# EAGLE board MotorControl_M (EAGLE 9.6.2), part 1 of 2
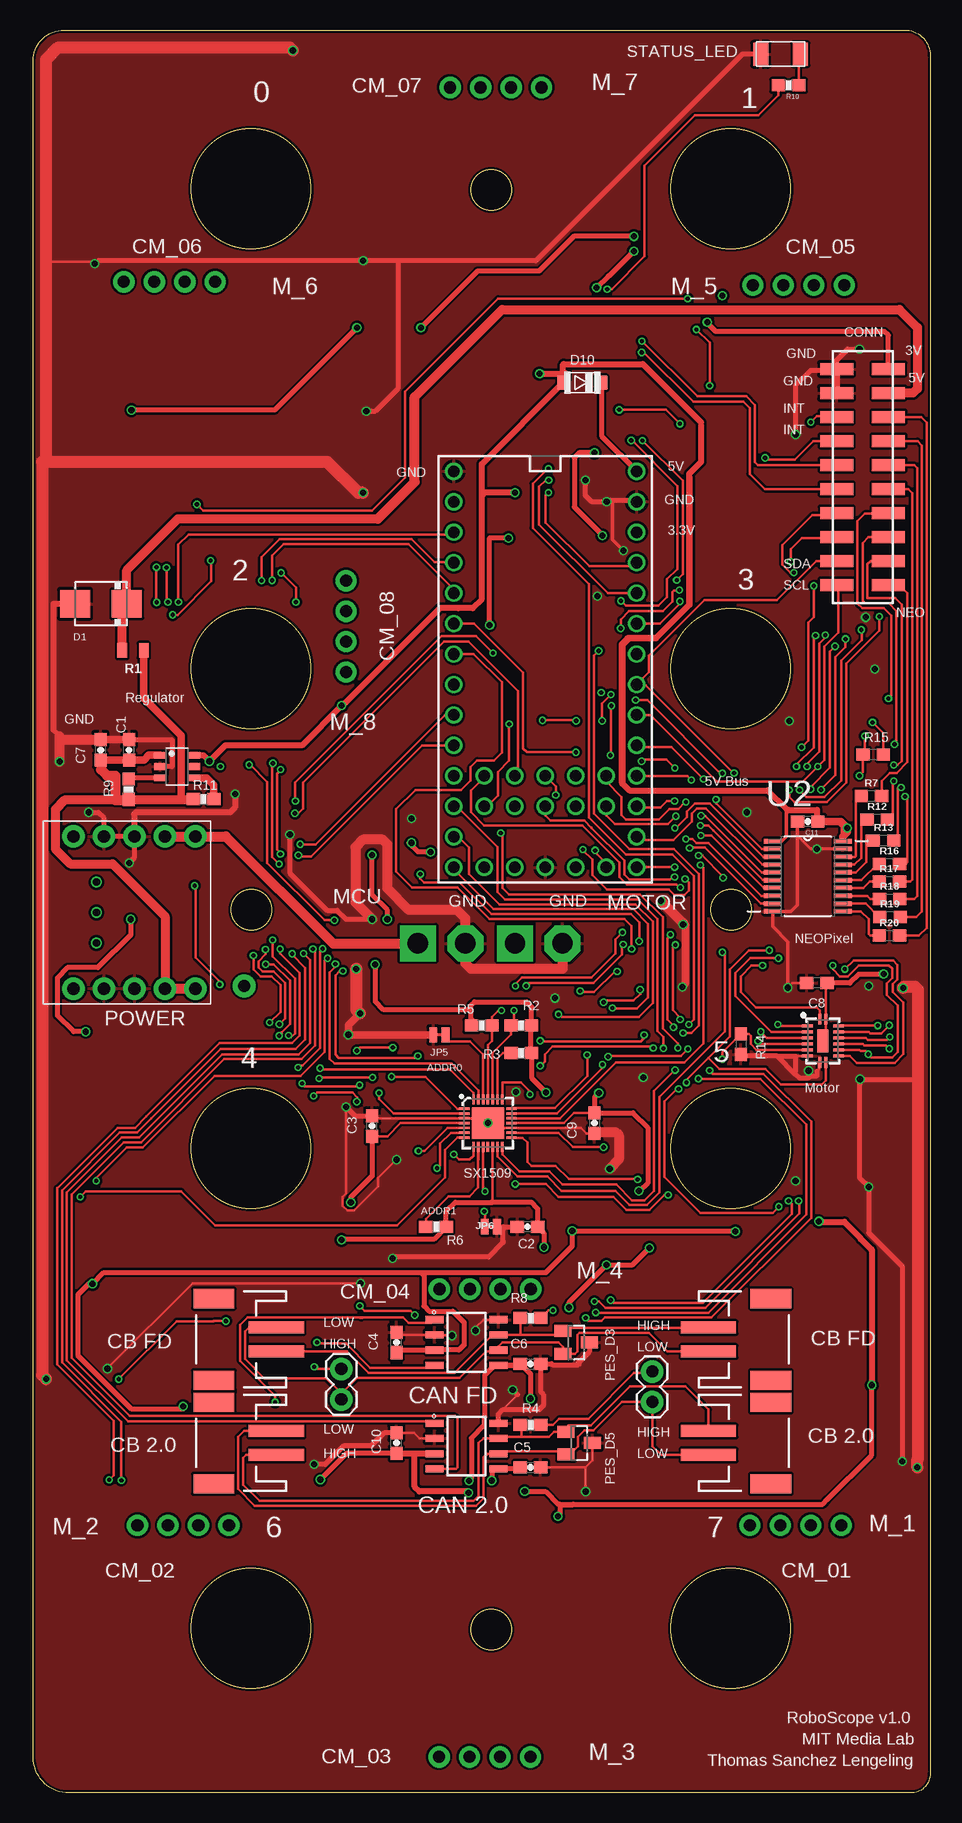
[diagram p3: board, top side]
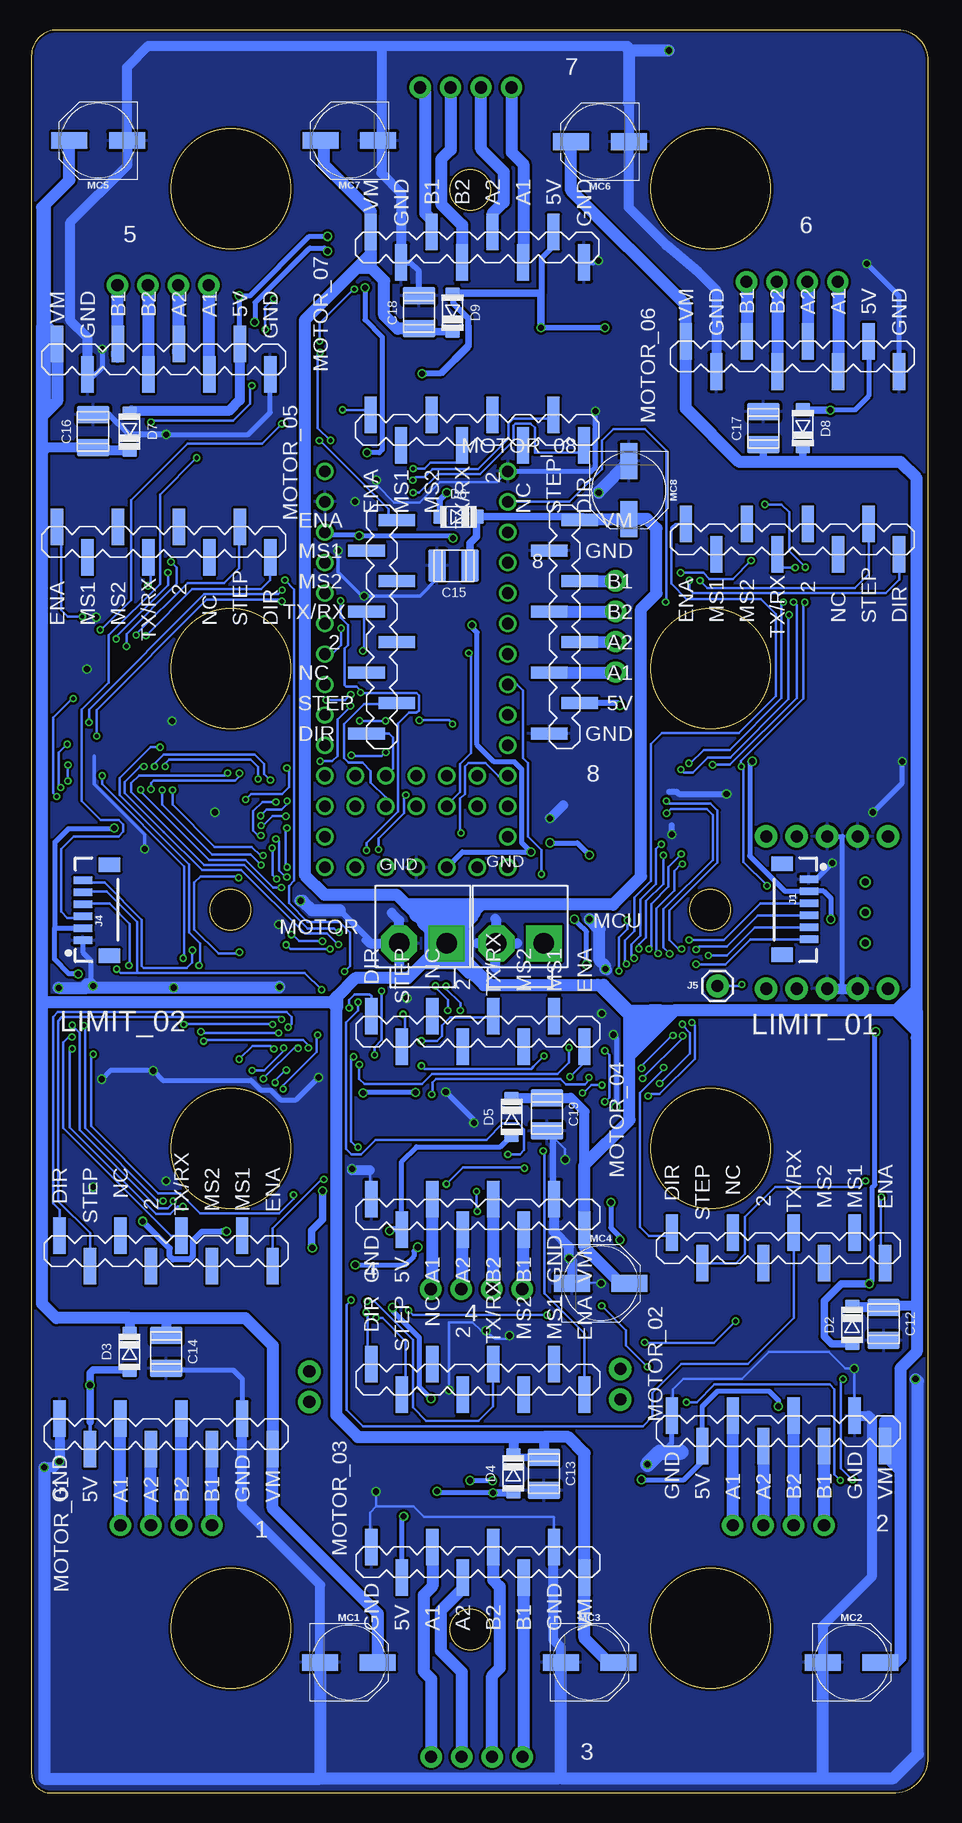
[diagram p4: board, bottom side, seen from below]

Size 74.79 x 146.95 mm. Coordinates in mm from the lower left corner, seen from the top.
Outline: 0,2.98 0,144.39 arc-90 2.56,146.95 72.66,146.95 arc-90 74.79,144.82 74.79,1.6 arc-90 73.19,0 2.98,0 arc-90 0,2.98
Outline: circle at 18.2,73.62 radius 1.7
Outline: circle at 38.2,133.62 radius 1.7
Outline: circle at 38.2,13.62 radius 1.7
Outline: circle at 58.2,73.62 radius 1.7
Outline: circle at 58.16,133.71 radius 5
Outline: circle at 58.16,93.71 radius 5
Outline: circle at 58.16,53.71 radius 5
Outline: circle at 58.16,13.71 radius 5
Outline: circle at 18.16,13.71 radius 5
Outline: circle at 18.16,53.71 radius 5
Outline: circle at 18.16,93.71 radius 5
Outline: circle at 18.16,133.71 radius 5
Copper layers (1*16): Top 0.035mm / dielectric 1.5mm / Bottom 0.035mm
Design rules "SparkFun-2-Layer-Minimum-JLCPCB": minimum track width 5mil, minimum drill 0.3mm, track to track 5mil, track to pad 5mil, pad to pad 5mil, via to via 5mil, smd to smd 5mil, copper to edge 7mil, drill to drill 7mil, minimum pad ring 5mil, minimum via ring 5mil, stop-mask expansion 2.5mil, vias tented up to drill 25mil, thermal gap 10mil
Net classes: 0 default: drill 0.35 mm, clearance 0.2 mm; 1 gnd: width 0.2 mm, drill 0.508 mm, clearance 0.2 mm; 3 vcc: width 0.2 mm, drill 0.508 mm, clearance 0.2 mm; 4 vcc5: width 0.55 mm, drill 0.508 mm, clearance 0.2 mm

## Footprints (pad centres in the part's own frame; a part is rotated, then mirrored left to right if it is on the bottom)
0603-CAP = smd 1.1 x 1: 1 -0.85,0; 2 0.85,0
0603 = smd 1.1 x 1: 1 -0.85,0; 2 0.85,0
C1210 = smd 2.7 x 1.45: 1 0,1.4; 2 0,-1.35
JST-2-SMD = smd 1 x 4.6: 1 -1,-3.7; 2 1,-3.7 | smd 1.6 x 3.4: NC1 -3.4,1.5; NC2 3.4,1.5
1X04-CLEANBIG = drill 1.016 pad 1.778: 1 -3.81,0; 2 -1.27,0; 3 1.27,0; 4 3.81,0
DO214AA = smd 2.5 x 2.3: A 2.15,0; C -2.15,0
SOD123 = smd 1.2 x 1: A 0,-1.6; C 0,1.6
1X06-1MM = smd 0.6 x 1.55: 1 -2.54,1.27; 2 -1.54,1.27; 3 -0.54,1.27; 4 0.46,1.27; 5 1.46,1.27; 6 2.46,1.27 | smd 1.2 x 1.8: P$1 -3.84,-0.955; P$2 3.76,-0.955
1X02 = drill 1.016 pad 1.88: 1 0,0; 2 2.54,0
1X01 = drill 1.016 pad 1.88: 1 0,0
SMT-JUMPER_2_NC_TRACE_NO-SILK = smd 0.635 x 1.27: 1 -0.508,0; 2 0.508,0
PANASONIC_D = smd 3 x 1.4: + 2.4,0; - -2.4,0
SOIC127P600X175-8N = smd 1.5 x 0.6: 1 -2.65,1.905; 2 -2.65,0.635; 3 -2.65,-0.635; 4 -2.65,-1.905; 5 2.65,-1.905; 6 2.65,-0.635; 7 2.65,0.635; 8 2.65,1.905
TMC2209_SMD = smd 3.048 x 1.016: 5V 8.89,-6.35; 9 -6.35,-1.27; A1 6.35,-3.81; A2 8.89,-1.27; B1 8.89,3.81; B2 6.35,1.27; DIR -8.89,-8.89; ENA -6.35,8.89; GND_0 6.35,-8.89; GND_1 6.35,6.35; MS1 -8.89,6.35; MS2 -6.35,3.81; STBY -8.89,-3.81; STEP -6.35,-6.35; TX/RX -8.89,1.27; VM 8.89,8.89
87759-20 = smd 1 x 2.75: 1 -9,-2.15; 2 -9,2.15; 3 -7,-2.15; 4 -7,2.15; 5 -5,-2.15; 6 -5,2.15; 7 -3,-2.15; 8 -3,2.15; 9 -1,-2.15; 10 -1,2.15; 11 1,-2.15; 12 1,2.15; 13 3,-2.15; 14 3,2.15; 15 5,-2.15; 16 5,2.15; 17 7,-2.15; 18 7,2.15; 19 9,-2.15; 20 9,2.15
SOT23 = smd 1 x 1.4: 1 -0.95,-1.1; 2 0.95,-1.1; 3 0,1.1
B2P-VH = drill 1.7 pad 3 square: 1 -1.98,0 | drill 1.7 pad 3 octagon: 2 1.98,0
0805 = smd 0.8 x 1.2: 1 -0.9,0; 2 0.9,0
0603-RES = smd 1.1 x 1: 1 -0.85,0; 2 0.85,0
LED1206FAB = smd 1.27 x 1.905: 1 -1.651,0; 2 1.651,0
QFN-28 = smd 0.85 x 0.2: 1 -1.975,1.2; 2 -1.975,0.8; 3 -1.975,0.4; 4 -1.975,0; 5 -1.975,-0.4; 6 -1.975,-0.8; 7 -1.975,-1.2; 15 1.975,-1.2; 16 1.975,-0.8; 17 1.975,-0.4; 18 1.975,0; 19 1.975,0.4; 20 1.975,0.8; 21 1.975,1.2 | smd 0.2 x 0.85: 8 -1.2,-1.975; 9 -0.8,-1.975; 10 -0.4,-1.975; 11 0,-1.975; 12 0.4,-1.975; 13 0.8,-1.975; 14 1.2,-1.975; 22 1.2,1.975; 23 0.8,1.975; 24 0.4,1.975; 25 0,1.975; 26 -0.4,1.975; 27 -0.8,1.975; 28 -1.2,1.975 | smd 2.65 x 2.65: 29 0,0
SOT23-6 = smd 1 x 0.55: 1 -1.4,0.95; 2 -1.4,0; 3 -1.4,-0.95; 4 1.4,-0.95; 5 1.4,0; 6 1.4,0.95
20-TSSOP = smd 1.473 x 0.356: 1 -2.921,2.921; 2 -2.921,2.286; 3 -2.921,1.626; 4 -2.921,0.965; 5 -2.921,0.33; 6 -2.921,-0.33; 7 -2.921,-0.965; 8 -2.921,-1.626; 9 -2.921,-2.286; 10 -2.921,-2.921; 11 2.921,-2.921; 12 2.921,-2.286; 13 2.921,-1.626; 14 2.921,-0.965; 15 2.921,-0.33; 16 2.921,0.33; 17 2.921,0.965; 18 2.921,1.626; 19 2.921,2.286; 20 2.921,2.921
DHVQFN-16-2.5X3.5MM = smd 0.9 x 0.24: 1 -1.8,-0.25; 8 1.8,-0.25; 9 1.8,0.25; 16 -1.8,0.25 | smd 0.24 x 0.9: 2 -1.25,-1.3; 3 -0.75,-1.3; 4 -0.25,-1.3; 5 0.25,-1.3; 6 0.75,-1.3; 7 1.25,-1.3; 10 1.25,1.3; 11 0.75,1.3; 12 0.25,1.3; 13 -0.25,1.3; 14 -0.75,1.3; 15 -1.25,1.3 | smd 1.9 x 0.9: EP 0,0
MOSFET_SLIDER = drill 1.016 pad 1.88: GND_1 1.27,8.89; GND_2 1.27,6.35; GND_3 13.97,8.89; GND_4 13.97,6.35; GND_5 13.97,3.81; ON 1.27,3.81; VIN_1 1.27,13.97; VIN_2 1.27,11.43; VOUT_1 13.97,13.97; VOUT_2 13.97,11.43 | drill 0.6: P$13 5.08,5.715; P$14 7.62,5.715; P$15 10.16,5.715
TEENSY_4.0_WITH_SMD_HEADER_PINS = drill 0.965: 0 -7.62,13.97; 1 -7.62,11.43; 2 -7.62,8.89; 3 -7.62,6.35; 3.3V 7.62,11.43; 3.3V1 -2.54,-16.51; 4 -7.62,3.81; 5 -7.62,1.27; 6 -7.62,-1.27; 7 -7.62,-3.81; 8 -7.62,-6.35; 9 -7.62,-8.89; 10 -7.62,-11.43; 11 -7.62,-13.97; 12 -7.62,-16.51; 13 7.62,-16.51; 14/A0 7.62,-13.97; 15/A1 7.62,-11.43; 16/A2 7.62,-8.89; 17/A3 7.62,-6.35; 18/A4 7.62,-3.81; 19/A5 7.62,-1.27; 20/A6 7.62,1.27; 21/A7 7.62,3.81; 22/A8 7.62,6.35; 23/A9 7.62,8.89; 24 5.08,-11.43; 25 5.08,-8.89; 26 2.54,-11.43; 27 2.54,-8.89; 28 0,-11.43; 29 0,-8.89; 30 -2.54,-11.43; 31 -2.54,-8.89; 32 -5.08,-11.43; 33 -5.08,-8.89; GND -7.62,16.51; GND1 0,-16.51; GND2 7.62,13.97; PGM 2.54,-16.51; RESET 5.08,-16.51; VBAT -5.08,-16.51; VIN 7.62,16.51

## Placement (x,y rotation side)
C1  47uf/10V  [0603-CAP]  7.99,86.95 90 top
C2  0.1uF  [0603-CAP]  41.21,47.2 180 top
C3  0.1uF  [0603-CAP]  28.26,55.58 90 top
C4  0.1uf  [0603-CAP]  30.29,37.55 90 top
C5  0.1uf  [0603-CAP]  41.47,27.13 0 top
C6  0.1uf  [0603-CAP]  41.47,35.77 0 top
C7  0.1uf  [0603-CAP]  5.63,86.95 90 top
C8  0.1uF  [0603]  65.34,67.52 180 top
C9  0.1uF  [0603-CAP]  46.8,55.83 270 top
C10  0.1uf  [0603-CAP]  30.29,29.16 90 top
C11  1uf  [0603-CAP]  64.58,80.98 180 top
C12  10uf  [C1210]  3.75,39.12 180 bottom
C13  [C1210]  32.07,26.62 180 bottom
C14  [C1210]  63.57,36.78 180 bottom
C15  [C1210]  39.56,102.29 90 bottom
C16  [C1210]  69.66,113.49 0 bottom
C17  [C1210]  13.78,113.75 0 bottom
C18  [C1210]  42.48,123.4 0 bottom
C19  [C1210]  31.82,56.6 180 bottom
CAN_INPUT  [JST-2-SMD]  16.58,37.8 90 top
CAN_INPUT1  [JST-2-SMD]  60.01,37.8 270 top
CAN_INPUT4  [JST-2-SMD]  60.01,29.16 270 top
CAN_INPUT5  [JST-2-SMD]  16.58,29.16 90 top
CM_01  1X04_STRAIGHT  [1X04-CLEANBIG]  63.57,22.31 180 top
CM_02  1X04_STRAIGHT  [1X04-CLEANBIG]  12.51,22.31 180 top
CM_03  1X04_STRAIGHT  [1X04-CLEANBIG]  37.66,3 180 top
CM_04  1X04_STRAIGHT  [1X04-CLEANBIG]  37.68,41.99 180 top
CM_05  1X04_STRAIGHT  [1X04-CLEANBIG]  63.82,125.68 0 top
CM_06  1X04_STRAIGHT  [1X04-CLEANBIG]  11.37,125.96 0 top
CM_07  1X04_STRAIGHT  [1X04-CLEANBIG]  38.58,142.17 0 top
CM_08  1X04_STRAIGHT  [1X04-CLEANBIG]  26.09,97.24 90 top
D1  S2A  [DO214AA]  5.65,99.12 180 top
D2  [SOD123]  6.37,39.02 0 bottom
D3  [SOD123]  66.61,36.78 0 bottom
D4  [SOD123]  34.61,26.62 0 bottom
D5  [SOD123]  34.76,56.34 0 bottom
D6  [SOD123]  39.18,106.38 270 bottom
D7  [SOD123]  66.61,113.49 180 bottom
D8  [SOD123]  10.48,113.75 180 bottom
D9  [SOD123]  39.69,123.4 180 bottom
D10  SOD123L  [SOD123]  45.79,117.56 270 top
DRILEGEND  [DRILEGEND]  -89,95.04 0 top  (outside the outline)
J1  [1X06-1MM]  11.24,73.61 270 bottom
J2  [1X02]  25.69,35.34 270 top
J3  [1X02]  51.63,35.13 270 top
J4  [1X06-1MM]  69.23,73.61 90 bottom
J5  [1X01]  17.59,67.26 0 bottom
JP5  JUMPER-SMT_2_NC_TRACE_NO-SILK  [SMT-JUMPER_2_NC_TRACE_NO-SILK]  33.87,63.17 180 top
JP6  JUMPER-SMT_2_NC_TRACE_NO-SILK  [SMT-JUMPER_2_NC_TRACE_NO-SILK]  38.17,47.2 180 top
MC1  100uF  [PANASONIC_D]  48.33,10.88 0 bottom
MC2  100uF  [PANASONIC_D]  6.42,10.88 0 bottom
MC3  100uF  [PANASONIC_D]  28.26,10.88 0 bottom
MC4  100uF  [PANASONIC_D]  27.32,42.48 0 bottom
MC5  100uF  [PANASONIC_D]  69.23,137.74 180 bottom
MC6  100uF  [PANASONIC_D]  27.4,137.65 180 bottom
MC7  100uF  [PANASONIC_D]  48.28,137.74 180 bottom
MC8  100uF  [PANASONIC_D]  24.99,108.6 270 bottom
MCP2562_2.0  MCP2562-E/SN  [SOIC127P600X175-8N]  36.13,28.91 0 top
MCP2562FD  MCP2562-E/SN  [SOIC127P600X175-8N]  36.13,37.55 0 top
MOTOR_01  DRV8880TMC2209  [TMC2209_SMD]  63.57,37.55 270 bottom
MOTOR_02  DRV8880TMC2209  [TMC2209_SMD]  12.51,37.8 270 bottom
MOTOR_03  DRV8880TMC2209  [TMC2209_SMD]  37.57,26.85 270 bottom
MOTOR_04  DRV8880TMC2209  [TMC2209_SMD]  37.57,55.84 270 bottom
MOTOR_05  DRV8880TMC2209  [TMC2209_SMD]  63.77,111.89 90 bottom
MOTOR_06  DRV8880TMC2209  [TMC2209_SMD]  11.34,112.12 90 bottom
MOTOR_07  DRV8880TMC2209  [TMC2209_SMD]  37.62,121.22 90 bottom
MOTOR_08  DRV8880TMC2209  [TMC2209_SMD]  37.97,97.21 0 bottom
P1  M-2X10-87759  [87759-20]  69.15,109.68 90 top
PES_D3  PESD1CAN  [SOT23]  45.28,37.55 270 top
PES_D5  PESD1CAN  [SOT23]  45.53,29.16 270 top
POWER_M  B2P-VH  [B2P-VH]  42.15,70.82 180 bottom
POWER_MCU  B2P-VH  [B2P-VH]  34.05,70.82 180 bottom
R1  0.3  [0805]  8.32,95.23 0 top
R2  10K  [0603-RES]  40.71,63.96 0 top
R3  10K  [0603-RES]  40.71,61.68 0 top
R4  120  [0603-RES]  41.47,30.69 0 top
R5  10K  [0603-RES]  37.4,63.96 180 top
R6  10K  [0603-RES]  33.59,47.2 0 top
R7  100  [0603]  69.89,83.11 0 top
R8  120  [0603-RES]  41.47,39.58 0 top
R9  10K  [0603-RES]  7.97,83.67 90 top
R10  500  [0603-RES]  62.98,142.35 180 top
R11  10K  [0603-RES]  14.21,82.83 0 top
R12  100  [0603]  70.37,81.16 0 top
R13  100  [0603]  70.91,79.41 0 top
R14  10k  [0603]  58.99,62.41 270 top
R15  1k  [0603]  70.04,86.57 0 top
R16  100  [0603]  71.39,77.45 0 top
R17  100  [0603]  71.39,75.98 0 top
R18  100  [0603]  71.41,74.5 0 top
R19  100  [0603]  71.44,73.03 0 top
R20  100  [0603]  71.39,71.45 0 top
STATUS_LED  LEDFAB1206  [LED1206FAB]  62.32,144.94 180 top
SX1509  SX1509  [QFN-28]  37.91,55.83 0 top
U1  MIC2005  [SOT23-6]  12,85.55 0 top
U2  74HCT245D,65220-TSSOP  [20-TSSOP]  64.58,76.41 0 top
U4  74HC4051BQ  [DHVQFN-16-2.5X3.5MM]  65.85,62.69 270 top
U$1  MOSFET_SLIDER  [MOSFET_SLIDER]  -0.44,81.01 270 top
U$3  TEENSY_4.0_WITH_SMD_HEADER_PINS  [TEENSY_4.0_WITH_SMD_HEADER_PINS]  42.7,93.66 0 top

## Tracks (layer width: path | path; a pad name or v marks a point on that pad's centre or on a via)
3.3V  (via drill 0.51)
  Top 0.2: 38.19,49.25 38.19,49.28 38.31,49.25 | SX1509.12 38.31,49.23
  Top 0.203: C9.1 45.09,56.68 44.24,55.83 SX1509.18 | SX1509.4 30.63,55.83 29.53,54.73 C3.1 | R3.2 R2.2 41.51,64.01 41.5,64.01 | SX1509.12 38.31,49.37 38.19,49.25 | R5.2 36.55,64.44 36.53,64.47 | 40.96,26.88 40.96,27.13 C5.1 | 38.31,49.25 38.34,49.25 | 38.67,49.25 38.34,49.25 | 38.34,49.25 38.31,49.23
  Top 0.406: v56.2,122.59 56.18,122.56 56.91,121.82 70.98,121.82 71.3,121.5 P1.19 | v50.1,128.53 48.02,126.45 47.95,126.45 v46.98,125.48 | v46.8,111.71 45.53,111.71 45.13,111.31 45.13,107.19 47.46,104.86 v47.46,104.81 | 41.51,64.01 41.51,61.72 R3.2 41.56,59.61 v42.76,58.4 | R2.2 41.56,65.53 41.15,65.94 36.78,65.94 36.53,65.69 36.53,65.28 | 36.7,64.22 36.7,64.32 36.55,64.47 36.53,64.47 36.53,65.28 | 41.48,63.99 41.5,64.01 | v28.51,69.04 28.51,65.99 29.22,65.28 36.53,65.28 | v29.53,72.83 29.53,73.59 28.26,74.86 v28.26,78.19 | v33.14,78.44 32.07,78.44 31.31,79.2 v31.56,79.2 | 38.19,49.25 38.31,49.25 | 38.67,49.25 41.03,49.25 | 41.03,49.25 41.53,49.25 42.06,48.72 C2.1 42.59,46.68 v42.59,45.5 | v38.06,97.34 38.06,104.6 v39.64,104.6 | v25.72,46.11 25.77,46.16 33.4,46.16 R6.2 34.44,48.47 35.21,49.23 38.31,49.23 41,49.23 41.03,49.25 | C3.1 28.26,51.43 26.48,49.65 v26.48,49.23 | v47.16,58.35 46.8,57.99 C9.1 50.02,56.68 51.24,55.46 51.24,50.81 50.6,50.17 v50.51,50.17 | v51.37,45.42 49.98,44.02 v47.79,44.02 44.68,40.91 v44.68,40.46 | C5.1 40.49,27 MCP2562_2.0.5 38.24,27 v38.24,26.04 | v36.34,26.01 36.54,26.21 36.54,29.57 37.63,30.66 37.63,31.28 37.66,31.31 37.66,34.84 38.43,35.62 40.47,35.62 C6.1 | C6.1 41.47,34.92 v41.47,32.86 | MCP2562FD.5 40.49,35.64 C6.1
  Bottom 0.203: 51.43,45.47 v51.37,45.42
  Bottom 0.406: v50.1,128.53 50.36,128.78 51.6,128.78 56.15,124.24 56.15,122.64 v56.2,122.59 | v46.8,111.71 45.79,111.71 45.54,111.96 45.54,121.35 46.98,122.79 v46.98,125.48 | U$3.3.3V1 38.87,78.44 v33.14,78.44 33.9,79.2 33.9,85.32 34.51,85.93 36.21,85.93 37.63,87.36 37.63,96.73 38.06,97.16 v38.06,97.34 | v28.51,69.04 28.51,71.79 29.17,72.45 29.17,72.47 v29.53,72.83 | v31.56,79.2 29.28,79.2 v28.26,78.19 | v26.48,49.23 26.48,47.1 25.72,46.34 v25.72,46.11 | v42.76,58.4 47.11,58.4 v47.16,58.35 | v50.51,50.17 50.57,50.11 | v47.79,44.02 43.63,44.02 42.92,44.73 42.92,45.17 v42.59,45.5 | v39.64,104.6 39.84,104.81 v47.46,104.81 47.54,104.88 50.11,104.88 U$3.3.3V | v36.34,26.01 36.37,26.04 v38.24,26.04 | v44.68,40.46 44.68,40.18 42.46,37.96 42.46,33.86 v41.47,32.86
  Bottom 0.61: v50.51,50.17 50.51,47.81 51.43,46.89 51.43,45.47
!RESET
  Top 0.203: SX1509.23 38.71,61.21 39.18,61.68 R3.1
CAN_H
  Top 0.203: 40.58,38.18 MCP2562FD.7 38.32,38.18 35.15,35.01 27.96,35.01 26.17,36.8 CAN_INPUT.1 | R8.1 40.62,38.22 40.58,38.18 | 40.58,38.18 43.86,38.18 PES_D3.1 44.44,38.76 55.71,38.76 55.75,38.8 CAN_INPUT1.1
CAN_H2
  Top 0.203: CAN_INPUT4.1 56.31,31.96 54.38,33.89 49.75,33.89 46.5,30.64 44.62,30.64 44.43,30.44 PES_D5.1 43.43,30.11 42.99,29.67 40.71,29.67 | CAN_INPUT5.1 17.74,28.16 17.5,27.93 17.5,25.7 18.86,24.34 36.72,24.34 37.15,24.77 37.15,29.16 37.53,29.54 MCP2562_2.0.7 38.91,29.67 40.71,29.67 | R4.1 40.71,30.6 40.71,29.67
CAN_L
  Top 0.203: CAN_INPUT1.2 52.88,36.8 51.33,38.35 45.55,38.35 45.37,38.17 45.37,36.8 45.17,36.6 PES_D3.2 44.18,37.18 43.8,37.56 39.13,37.56 38.78,37.22 MCP2562FD.6 38.67,36.8 37.77,36.8 35.57,34.6 26.99,34.6 25.7,33.3 | 25.7,33.3 24.43,34.57 19.27,34.57 17.67,36.17 17.67,38.47 18,38.8 CAN_INPUT.2 | 25.7,33.3 J2.2
CAN_L2
  Top 0.2: 46.18,30.23 45.97,30.23 45.43,29.69 45.43,28.91 44.74,28.21 PES_D5.2
  Top 0.203: PES_D5.2 44.19,28.45 38.96,28.45 MCP2562_2.0.6 37.88,28.28 37.56,27.95 37.56,24.55 36.94,23.93 18.48,23.93 17.08,25.33 17.08,29.67 17.58,30.16 CAN_INPUT5.2 | 46.18,30.23 46.73,30.23 49.09,32.59 J3.2 51.63,28.91 52.37,28.16 CAN_INPUT4.2
CAN_RX2  (via drill 0.35)
  Top 0.2: 23.5,62.29 23.5,70.1 23.32,70.29 v23.32,70.35 | v11.62,98.2 12.05,98.2 14.84,101 14.84,102.68 v14.8,102.72 | v20.64,85.3 20.33,84.99 20.33,81.74
  Top 0.203: MCP2562_2.0.4 35.25,27 35.37,27.13 35.37,31.25 35.19,31.43 8.07,31.43 3.22,36.28 3.22,49.9 7.55,54.23 9,54.23 15.93,61.17 22.39,61.17 23.5,62.29 | 20.33,81.76 20.33,81.74 20.33,78.62 20.61,78.34 v20.61,78.27 | v20.66,101.71 21.91,100.46 v21.91,99.27
  Bottom 0.2: v11.62,98.2 11.67,98.15 11.67,91.18 16.54,86.31 18.39,86.31 19.65,85.05 20.39,85.05 v20.64,85.3
  Bottom 0.203: v23.32,70.35 23.11,70.56 23.11,74.12 21.68,75.55 21.68,77.2 v20.61,78.27 | v14.8,102.72 16.32,101.2 18.25,101.2 18.76,101.71 v20.66,101.71 | v21.91,99.27 21.86,99.32 21.86,111.89 23.66,113.69 26.29,113.69 27.24,112.73 27.24,110.34 29.95,107.63 U$3.0
CAN_RX3  (via drill 0.35)
  Top 0.2: 9.42,56.37 15.56,62.51 21.59,62.51 22.22,63.14 22.22,68.35 20.59,69.98 v20.59,70.34
  Top 0.203: MCP2562FD.4 33.28,35.44 28.1,35.44 26.08,37.46 23.76,37.46 v23.66,37.56 | v16.07,39.33 15.06,39.33 15.05,39.32 11.95,39.32 v7.13,34.5 | v6.34,26.09 6.72,26.47 6.72,31.01 2,35.74 2,50.25 | v21.86,82.67 21.86,84.23 34.06,96.43 36.93,96.43 v38.34,95.02 | 2,50.25 2,50.41 | 2,50.25 2,50.41 7.04,55.45 8.5,55.45 9.42,56.37
  Bottom 0.2: v20.59,70.34 20.84,70.34 21.58,71.08 21.58,73.58 17.59,77.57
  Bottom 0.203: v23.66,37.56 23.61,37.51 17.89,37.51 v16.07,39.33 | v7.13,34.5 7.3,34.32 7.3,27.06 v6.34,26.09 | U$3.30 40.16,82.36 39.08,83.44 39.08,85.75 38.17,86.66 38.17,94.85 v38.34,95.02 | 17.59,77.57 17.59,81.9 18.17,82.48 21.67,82.48 v21.86,82.67
CAN_TX2  (via drill 0.35)
  Top 0.2: 19.93,81.46 19.93,85.78 v19.98,85.83 | v12.11,99.27 12.11,104.06 12.95,104.91
  Top 0.203: MCP2562_2.0.1 33.33,30.97 7.91,30.97 2.81,36.07 2.81,50.07 7.38,54.64 8.83,54.64 15.76,61.57 22.14,61.57 23.1,62.53 23.1,69.42 v22.54,69.98 | U$3.1 34.89,104.91 12.95,104.91 | 19.93,81.46 19.93,78.01 v20.51,77.42
  Bottom 0.2: v19.98,85.83 19.92,85.77 18.73,86.95 16.57,86.95 12.26,91.27 12.26,99.11 v12.11,99.27
  Bottom 0.203: v22.54,69.98 22.69,70.13 22.69,73.72 21.2,75.21 21.2,76.87 20.64,77.42 v20.51,77.42
CAN_TX3  (via drill 0.35)
  Top 0.127: 27.32,39.6 27.32,39.65
  Top 0.2: 9.82,56.21 15.62,62.01 21.87,62.01 22.68,62.81 22.68,68.78 21.58,69.88 v21.58,69.96
  Top 0.203: v21.82,81.66 22.1,81.66 22.52,82.07 22.52,84.23 34.26,95.97 36.3,95.97 40.44,91.83 40.44,85.05 U$3.31 | v7.36,26.07 7.36,30.95 2.4,35.9 2.4,50.24 7.2,55.04 8.66,55.04 9.82,56.21 | v20.18,32.57 20.18,33.09 17.27,36 17.27,39.02 17.9,39.65 27.32,39.65 30.85,39.65 31.31,39.2 33.23,39.2 MCP2562FD.1 | 27.24,39.6 27.32,39.6 27.45,39.6
  Bottom 0.2: 18,81.51 18,77.76 22.09,73.67 22.09,70.46 v21.58,69.96
  Bottom 0.203: v7.36,26.07 7.86,26.57 7.86,33.66 8.25,34.04 17.85,34.04 19.32,32.57 v20.18,32.57 | v21.82,81.66 21.48,82 18.48,82 18,81.51
GND_MCU  (via drill 0.51)
  Top 0.2: C4.2 30.32,38.49 30.39,38.49 | v46.07,25.12 46.07,27.12 46.04,27.13 | v62.93,67.12 63.31,67.5 64.44,67.5 C8.2 | 1.08,127.62 5.07,127.62 v5.15,127.46 | 39.19,45.99 37.84,44.64 37.66,44.64 | v34.94,38.12 33.57,38.12 MCP2562FD.2 | 73.47,59.49 73.77,59.49 | v64.65,60.2 64.65,59.77 64.65,59.52
  Top 0.203: C9.2 46.13,54.98 45.68,55.43 SX1509.17 38.62,55.43 38.51,55.33 38.42,55.33 SX1509.29 37.4,56.34 36.9,56.34 36.79,56.23 SX1509.3 28.46,56.23 C3.2 28.44,56.37 | C5.2 46.04,27.13 46.63,27.72 PES_D5.3 | 46.38,36.78 46.38,36.61 45.53,35.77 | MCP2562_2.0.2 32.21,29.54 31.74,30.01 C10.2 | MCP2562FD.2 30.51,38.18 C4.2 | 40.39,33.19 39.17,31.97 | 27.75,56.43 27.59,56.43 | v27.29,42.47 13.29,42.47 v6.19,35.37 | MCP2562FD.8 37.53,39.45 36.9,38.82 v36.9,38.54 | R14.2 58.6,61.56 58.74,61.42 58.99,61.42 | 63.57,61.42 64.53,61.42 U4.7 | U4.8 65.5,60.79 65.5,60.3 65.34,60.15 | 64.65,59.52 63.95,59.52 63.57,59.9 63.57,60.15 | v52.35,74.37 52.35,74.19 52.61,74.44 52.41,74.44 | v26.08,57.18 26.08,49.96 25.8,49.68 25.8,48.95 26.2,48.55 26.77,48.55 28.77,50.55 28.77,51.26 v30.29,52.79
  Top 0.254: U2.19 v65.34,78.69 64.84,78.69 63.73,79.8 C11.2
  Top 0.305: C11.2 63.73,74.03 63.19,73.49 U2.10 61.66,72.22 62.93,70.95 v62.93,67.12 | v47.82,107.65 48.3,107.65 48.3,104.48 v49.22,103.56
  Top 0.406: v72.46,27.64 72.46,43.9 69.66,46.69 v69.66,50.5 68.94,51.22 v68.94,59.49 73.47,59.49 | C10.2 29.28,30.01 28.19,28.92 25.89,28.92 24.35,27.39 v23.43,27.39 | v5.15,127.46 5.42,127.74 27.5,127.74 v27.52,127.72 | v27.78,115.19 28.54,115.19 30.42,117.07 30.42,127.72 v27.52,127.72 | STATUS_LED.2 59.14,144.94 41.92,127.72 v27.52,127.72 | U$3.GND2 50.24,107.71 47.88,107.71 v47.82,107.65 46.55,107.65 46.04,108.16 v46.04,109.43 | v63.57,113.24 63.57,117.3 64.84,118.57 66.89,118.57 P1.20 67,119.44 67.91,120.35 v68.9,120.35 | JP6.1 39.2,47.2 | 39.2,47.2 C2.2 | 8.42,79.76 U$1.GND_1 U$1.GND_2 5.91,81.26 5.42,81.74 v4.64,81.74 | 8.42,79.81 8.42,77.93 v8.02,77.53 | C1.2 11.57,87.8 11.57,85.55 U1.2 | C7.2 5.41,87.58 2.71,87.58 2.2,88.09 1.69,88.6 | v21.4,79.89 21.38,79.87 21.38,76.68 24.51,73.56 25.35,73.56 26.08,72.83 v28.26,72.83 | v54.12,67.19 54.24,67.31 | 27.59,56.43 26.82,56.43 v26.08,57.18 | C3.2 27.75,56.43 | v29.96,44.57 30.07,44.68 37.99,44.68 39.19,45.88 39.19,45.99 39.19,46.96 39.2,46.98 39.2,47.2 | v39.99,33.59 40.39,33.19 | MCP2562_2.0.8 38.78,31.58 39.17,31.97 42.22,31.97 42.55,32.29 42.55,33.2 42.32,33.43 C6.2 43.24,35.77 43.31,35.69 45.46,35.69 | 45.53,35.77 45.46,35.69 | 45.46,35.69 45.46,35.86 46.38,36.78 PES_D3.3 | v64.65,60.2 64.65,59.63 64.58,59.56 63.9,59.56 63.57,59.9 62.04,61.42 | 62.04,61.42 58.99,61.42 | 62.04,61.42 63.57,61.42 63.57,60.15 | 64.65,59.77 65.34,59.77 65.34,60.15
  Top 0.508: 1.69,88.6 1.69,99.12 D1.A | P1.20 P1.18 | v16.83,83.27 16.83,82.15 16.43,81.74 8.58,81.74 8.42,81.59 8.42,79.76
  Top 0.61: C7.2 C1.2 | v27.24,64.98 26.28,64.01 v26.28,63.2 26.3,63.18 JP5.2 | v54.19,72.4 54.4,72.4 54.4,67.47 v54.12,67.19
  Top 0.813: C9.2 46.86,55.04 48.61,55.04 48.83,54.82 48.83,52.79 v48.07,52.02 | POWER_M.2 44.13,68.68 36.49,68.68 36.03,69.15 POWER_MCU.2 36.03,72.9 35.32,73.61 31.31,73.61 29.53,75.39 29.53,79.07 29.15,79.46 27.5,79.46 26.86,78.82 26.86,74.23 v28.26,72.83 | v2.2,85.96 2.2,87.58 | 2.2,87.58 2.2,88.09 | 2.2,87.58 2.42,87.8 C7.2 | v54.19,72.4 54.19,72.53 v52.35,74.37
  Top 1.016: v1.08,34.5 0.75,34.83 0.75,110.95 1.08,110.95 | 1.08,110.95 1.08,127.62 1.08,144.48 2.1,145.5 21.4,145.5 v21.66,145.24 | v26.94,68.69 26.94,65.28 v27.24,64.98 | v72.53,67.11 72.61,67.19 73.52,67.19 73.77,66.94 73.77,59.49 73.77,27.87 73.73,27.82 v73.73,27.13 | v27.5,108.39 27.09,108.39 24.53,110.95 1.08,110.95
  Bottom 0.2: MOTOR_03.GND_0 46.57,20.61 46.57,23.36 46.07,23.87 | 46.07,23.87 v46.07,25.12 | v62.93,67.12 62.93,67.14 | v29.96,44.57 29.98,44.57 | v34.94,38.12 35.19,37.87 36.16,37.87 36.64,38.28 v36.9,38.54 37.32,38.54 38.02,39.23 39.99,39.23 v39.99,33.59 | 46.07,23.87 42.94,23.87 42.08,23.01 31.25,23.01 31.22,22.98 MOTOR_03.GND_1 | v6.19,35.37 6.95,35.37 8.33,36.74 13.32,36.74 15.56,34.5 20.44,34.5 21.32,33.63 21.32,31 MOTOR_02.GND_0
  Bottom 0.203: U$3.GND 35.97,109.28 40.73,109.28 42.44,107.58 44.57,107.58 46.04,109.04 v46.04,109.43 | v27.29,42.47 27.39,42.57 27.62,42.57 MC4.- | v6.19,35.37 6.19,31.12 MOTOR_02.GND_1 | v6.19,35.37 | 46.68,49.23 46.46,49.45 MOTOR_04.GND_0 46.41,49.57 46.57,50.62 46.57,51.89 | C19.1 30.29,53.67 v30.29,52.79
  Bottom 0.305: 69.55,86.42 69.55,84.09 65.34,79.88 v65.34,78.69 | C15.1 40.96,101.2 42.39,99.78 v47.06,99.78 47.21,99.78 49.22,101.78 v49.22,103.56
  Bottom 0.406: v23.43,27.39 23.18,27.39 21.4,29.16 MOTOR_02.GND_0 | 7.18,67.01 7.18,79.73 U$1.GND_1 | MOTOR_07.GND_0 27.9,127.58 27.52,127.75 v27.52,127.72 | MOTOR_06.GND_0 2.45,124.77 v5.15,127.46 | MOTOR_05.GND_0 54.88,115.07 56.71,113.24 v63.57,113.24 | U$3.GND 28.12,110.17 27.78,110.52 v27.78,115.19 | v68.9,120.35 68.9,118.83 69.68,118.05 69.87,118.24 MOTOR_05.GND_1 | v26.28,63.2 26.02,62.95 26.02,57.23 v26.08,57.18 | J1.1 9.39,76.15 v8.02,77.53 | J4.1 70.5,70.06 69.84,69.4 69.84,67.39 | 70.17,67.39 70.17,67.14 70.17,67.11 | v4.64,81.74 2.2,84.18 v2.2,85.96 | v50.87,59.64 52.74,57.77 54.03,57.77 54.84,58.58 55.68,58.58 56.49,59.39 63.84,59.39 v64.65,60.2 68.23,60.2 v68.94,59.49 | SX1509.29 37.91,56.09 v40.25,58.42 | C14.1 63.44,35.26 57.98,35.26 57.22,34.5 57.22,30.43
  Bottom 0.508: 46.8,71.07 47.06,71.07 | 44.13,69.17 44.26,69.04 | 49.09,73.59 46.32,70.82 POWER_M.2 | C16.1 68.35,114.89 66.7,113.24 v63.57,113.24 | MOTOR_07.GND_1 43.23,127.58 42.48,126.83 C18.1 | 21.64,83.45 21.01,83.45 20.82,83.27 v16.83,83.27 | v21.4,79.89 21.4,80.67
  Bottom 0.55: C19.1 31.29,55.2 31.29,48.93 MOTOR_04.GND_1
  Bottom 0.813: MOTOR_02.GND_1 5.02,31.45 4.74,31.17 4.74,18 8.82,13.92 MC2.- | MC3.- 30.66,12.15 31.31,12.79 31.31,19.77 MOTOR_03.GND_1 | MC1.- 50.73,10.54 50.71,10.53 50.71,17.33 57.22,23.83 57.22,30.43 MOTOR_01.GND_1 | v29.96,44.57 29.72,44.33 MC4.- | 29.98,44.57 29.98,45.53 31.25,46.8 31.25,48.38 31.22,48.41 MOTOR_04.GND_1 | MOTOR_06.GND_1 17.69,125.28 19.18,126.76 21.86,129.01 25,132.15 MC6.- 25,140.92 25,145.54 25.08,145.62 45.62,145.62 | MOTOR_05.GND_1 70.12,121.32 71.54,122.74 71.54,130.91 66.83,135.63 MC5.- 66.83,143.84 65.04,145.62 45.62,145.62 | MC7.- 45.62,138 | 45.62,145.62 45.62,138 | 45.62,138 45.62,135.02 43.97,133.37 MOTOR_07.GND_1 | v48.07,52.02 48.07,51.89 46.57,51.89 | v26.94,68.69 26.81,68.56 | 5.73,67.03 U$1.GND_3 8.44,67.01 7.18,67.01 | MOTOR_01.GND_0 v72.46,27.64 72.96,27.13 v73.73,27.13 | v72.53,67.11 69.81,67.11 v69.66,67.26 | v31.56,81.23 30.47,82.32 | 46.8,71.07 46.55,70.82 POWER_M.2 | POWER_M.2 44.13,69.17 | POWER_M.2 44.13,72.72 44.77,73.36 | POWER_MCU.2 36.13,70.72 36.13,68.79 | POWER_MCU.2 34.3,70.82 | POWER_MCU.2 36.03,72.75 36.13,72.85 | POWER_MCU.2 37.64,70.82
  Bottom 1.016: 45.54,137.83 45.88,137.49 MC7.- | 30.8,1.22 50.61,1.22 50.73,1.34 MC1.- 50.73,1.2 73.73,1.2 v73.73,27.13 | MC3.- 30.66,1.22 8.96,1.22 | MC2.- 8.82,1.36 8.96,1.22 | 8.96,1.22 2.93,1.22 0.89,3.26 0.89,34.31 v1.08,34.5 | v21.66,145.24 25,145.24 25,140.92 | v26.94,68.69 26.94,68.92 27.42,69.41 27.42,71.99 v28.26,72.83 | v52.35,74.37 52.18,74.37 51.4,73.59 49.09,73.59 | v54.12,67.19 54.17,67.14 62.93,67.14 70.17,67.14 | 69.84,67.39 70.17,67.39 | v72.53,67.11 70.17,67.11 | MC8.- 27.5,108.49 v27.5,108.39
  Bottom 1.27: v23.43,27.39 22.42,28.4 20.64,28.4
  other vias: 37.91,55.83 63.06,89.36 70.17,93.68 59.5,81.74 69.41,98 63.57,51.01 43.5,66.25
  pour Top (isolate 0.2): -10.09,151.85 111.57,151.85 111.57,-9.95 -10.09,-9.95
  pour Bottom (isolate 0.2): -8.06,151.85 93.28,151.85 93.28,-4.87 -8.06,-4.87
INPUT_01  (via drill 0.35)
  Top 0.203: v15.56,67.39 15.56,67.65 13.56,69.64 13.56,75.52 v13.46,75.62 | v10.3,99.24 10.28,99.27 10.28,102.16 v10.27,102.17 | v13.66,107.42 14.19,106.89 28.26,106.89 31,109.63 31,116.79 38.77,124.56 v54.57,124.56 | v55.3,121.98 56.41,120.87 v56.41,117.3 | P1.16 66.92,114.76 65.34,114.76 v64.84,114.25
  Bottom 0.203: J5.1 15.68,67.26 v15.56,67.39 | v13.46,75.62 15.43,77.6 15.43,85.38 v15.61,85.55 15.66,85.61 15.66,86.02 10.44,91.24 10.44,99.11 v10.3,99.24 | v10.27,102.17 11.62,103.52 11.62,106.75 12.27,107.4 13.63,107.4 v13.66,107.42 | v54.57,124.56 55.3,123.84 v55.3,121.98 | v56.41,117.3 56.56,117.15 56.56,115.79 57.97,114.38 64.71,114.38 v64.84,114.25
INPUT_02  (via drill 0.35)
  Top 0.203: P1.14 65.04,112.68 63.52,111.16 61.15,111.16 v61.03,111.29
  Bottom 0.203: J4.3 70.62,72.95 71.79,72.95 72.33,73.49 72.33,78.69 71.29,79.74 67.53,79.74 67.12,80.14 67.12,80.7 67.53,81.1 69.02,81.1 70.6,82.68 70.6,90.29 68.33,92.56 68.33,96.52 64.07,100.78 64.07,108.24 v61.03,111.29
INT_00
  Top 0.203: R6.1 32.74,47.84 34.64,49.73 36.39,49.73 37.11,50.46 37.11,52.79 | 37.11,52.79 37.11,53.3 | SX1509.9 37.11,52.79
INT_01  (via drill 0.35)
  Top 0.203: v66.87,95.59 66.44,95.15 66.44,85.46 64.83,83.85 v64.83,83.66 | v57.46,84.99 57.31,84.99 51.21,91.09 v50.23,91.09 | U$3.32 37.85,82.23 38.74,83.12 38.74,85.11 39.69,86.06 v39.69,89.11 | v63.16,102.62 63.16,103.69 64.08,104.61 66.93,104.61 P1.6 | v42.46,89.41 45.23,89.41 v45.28,89.36 | v47.44,89.36 47.44,90.81 v48.17,91.55
  Bottom 0.203: v64.83,83.66 64.83,84.16 64.6,84.39 57.8,84.39 57.46,84.73 v57.46,84.99 | v42.46,89.41 40,89.41 v39.69,89.11 | v66.87,95.59 66.87,96.6 62.68,100.79 62.68,102.14 v63.16,102.62 | v50.23,91.09 48.63,91.09 v48.17,91.55 | v45.28,89.36 v47.44,89.36
INT_02  (via drill 0.35)
  Top 0.203: v67.73,96.19 67.73,95.52 66.89,94.68 66.89,84.87 65.7,83.67 v65.7,83.62 | v53.97,75.47 53.89,75.47 53.64,75.72 49.52,75.72 48.89,76.36 48.89,77.54 45.78,80.65 37.61,80.65 36.5,81.75 36.5,83.55 37.62,84.67 U$3.33 | P1.8 66.83,106.51 64.96,106.51 62.47,104.02 62.47,102.39 63.13,101.73 v63.41,101.73
  Bottom 0.203: v67.73,96.19 67.73,96.37 63.41,100.69 v63.41,101.73 | v65.7,83.62 65.7,83.48 59.99,77.78 56.94,77.78 54.63,75.47 v53.97,75.47
MA1_01
  Bottom 1.016: CM_01.1 MOTOR_01.A1
MA1_02
  Bottom 1.016: CM_02.1 MOTOR_02.A1
MA1_03
  Bottom 1.016: CM_03.1 41.47,9.51 42.1,10.14 42.1,16.49 41.37,17.22 41.37,19.85 MOTOR_03.A1
MA1_04
  Bottom 1.016: MOTOR_04.A1 41.38,42.11 CM_04.1
MA1_05
  Bottom 1.016: MOTOR_05.A1 59.96,125.63 CM_05.1
MA1_06
  Bottom 1.016: MOTOR_06.A1 7.53,125.94 CM_06.1
MA1_07
  Bottom 1.016: MOTOR_07.A1 33.81,127.78 33.77,127.82 33.77,135.77 34.77,136.76 CM_07.1
MA1_08
  Bottom 1.016: MOTOR_08.A1 26.12,93.4 CM_08.1
MA2_01
  Bottom 1.016: CM_01.2 MOTOR_01.A2
MA2_02
  Bottom 1.016: MOTOR_02.A2 CM_02.2
MA2_03
  Bottom 1.016: MOTOR_03.A2 38.85,17.97 38.85,18.32 38.85,17 40.68,15.17 40.68,11.84 38.93,10.09 CM_03.2
MA2_04
  Bottom 1.016: CM_04.2 38.84,42.11 MOTOR_04.A2
MA2_05
  Bottom 1.016: CM_05.2 62.55,119.94 62.53,120.75 MOTOR_05.A2
MA2_06
  Bottom 1.016: MOTOR_06.A2 10.07,125.94 CM_06.2
MA2_07
  Bottom 1.016: MOTOR_07.A2 36.35,131.67 35.42,132.59 35.42,135.13 37.31,137.02 CM_07.2
MA2_08
  Bottom 1.016: MOTOR_08.A2 CM_08.2
MB1_01
  Bottom 1.016: CM_01.4 MOTOR_01.B1
MB1_02
  Bottom 1.016: CM_02.4 MOTOR_02.B1
MB1_03
  Bottom 1.016: MOTOR_03.B1 33.76,3.09 CM_03.4
MB1_04
  Bottom 1.016: CM_04.4 33.76,42.11 MOTOR_04.B1
MB1_05
  Bottom 1.016: CM_05.4 67.63,119.69 67.6,120.76 MOTOR_05.B1
MB1_06
  Bottom 1.016: CM_06.4 15.15,125.94 MOTOR_06.B1
MB1_07
  Bottom 1.016: CM_07.4 41.96,141.74 41.96,131.66 41.43,131.13 MOTOR_07.B1
MB1_08
  Bottom 1.016: CM_08.4 26.11,101.03 MOTOR_08.B1
MB2_01
  Bottom 1.016: CM_01.3 MOTOR_01.B2
MB2_02
  Bottom 1.016: CM_02.3 MOTOR_02.B2
MB2_03
  Bottom 1.016: CM_03.3 36.39,9.76 35.75,10.39 35.75,17.2 36.3,17.75 MOTOR_03.B2
MB2_04
  Bottom 1.016: MOTOR_04.B2 36.3,42.11 CM_04.3
MB2_05
  Bottom 1.016: MOTOR_05.B2 65.04,125.63 CM_05.3
MB2_06
  Bottom 1.016: CM_06.3 12.61,125.94 MOTOR_06.B2
MB2_07
  Bottom 1.016: CM_07.3 39.85,136.96 40.63,136.17 40.63,132.44 38.89,130.7 MOTOR_07.B2
MB2_08
  Bottom 1.016: MOTOR_08.B2 26.12,98.48 CM_08.3
MDIR_01  (via drill 0.35)
  Top 0.203: v32.27,76.59 32.27,76.2 32.58,75.9 35.56,75.9 38.2,73.26 49.83,73.26 50.54,72.56 v50.54,71 | v53.13,71.54 53.13,71.44 52.9,71.22 52.9,64.47 53.39,63.97 v53.39,63.82
  Bottom 0.203: MOTOR_01.DIR 72.46,48.59 72.99,49.13 72.99,64.7 72.61,65.08 53.51,65.08 53.11,64.69 53.11,64.1 v53.39,63.82 | v32.27,76.59 32.27,78.59 33.39,79.71 33.39,85.86 33.81,86.27 33.81,91.89 34.32,92.39 U$3.6 | v53.13,71.54 53.03,71.54 52.48,71 v50.54,71
MDIR_02  (via drill 0.35)
  Top 0.2: 23.91,68.48 23.91,70.13 v24.14,70.36
  Top 0.203: U$3.8 32.41,87.31 23.15,78.06 22.21,78.06 v22.11,78.16 | v22.09,60.48 22.27,60.66 22.47,60.66 23.91,62.1 23.91,68.48
  Bottom 0.2: MOTOR_02.DIR 21.66,46.44 23.32,46.44 24.07,47.18
  Bottom 0.203: v24.14,70.36 24.14,70.72 23.55,71.3 23.55,74.33 22.11,75.77 v22.11,78.16 | 24.07,47.18 24.07,58.33 22.09,60.31 v22.09,60.48
MDIR_03  (via drill 0.35)
  Top 0.203: v55.46,59.54 55.49,59.52 60.65,59.52 64.45,55.71 64.45,48.21 56.28,40.03 v46.91,40.03 v46.9,40.04 | v52.56,62.07 52.56,63.03 52.06,63.53 52.06,72.83 50.41,74.48 39.33,74.48 38.73,75.09 38.73,78.87 35.36,82.23 U$3.10
  Bottom 0.203: MOTOR_03.DIR 46.46,34.9 46.75,35.19 46.75,39.89 v46.9,40.04 | v55.46,59.54 52.75,62.26 v52.56,62.07
MDIR_04  (via drill 0.35)
  Top 0.2: 51.25,66.3 50.36,65.41 48.33,65.41 v48.3,65.44
  Top 0.203: 51.25,66.3 51.25,72.45 50.03,73.67 38.37,73.67 35.08,76.95 U$3.12
  Bottom 0.2: 46.46,65.5 46.46,65.23 MOTOR_04.DIR | v48.3,65.44 48.3,66.1
  Bottom 0.203: 48.3,66.1 47.84,66.55 46.6,66.55 46.46,66.41 46.46,65.23
MDIR_05  (via drill 0.35)
  Top 0.2: U$3.17/A3 50.32,87.17 53.23,87.17 v55.9,84.51 | v65.24,96.47 65.09,96.32 65.09,87.15 63.64,85.7 v63.64,85.55
  Bottom 0.2: v55.9,84.51 55.9,85.5 56.53,86.14 63.31,86.14 63.64,85.81 v63.64,85.55 | v65.24,96.47 61.38,100.34 55.64,100.34 54.88,101.09 MOTOR_05.DIR
MDIR_06  (via drill 0.35)
  Top 0.203: v19.93,101.07 19.93,103.13 20.89,104.09 31.31,104.09 35.08,100.32 U$3.3
  Bottom 0.203: MOTOR_06.DIR 2.45,101.15 3.57,100.03 19.65,100.03 19.93,100.31 v19.93,101.07
MDIR_07  (via drill 0.35)
  Top 0.203: U$3.23/A9 50.02,102.25 46.36,102.25 42.71,105.9 42.71,108.13 v42.97,108.39
  Bottom 0.203: v42.97,108.39 42.46,108.39 40.91,109.94 37.4,109.94 34.62,112.72 34.62,113.98 34.44,114.16 33.18,114.16 32.83,113.82 32.83,111.71 29.28,111.71 28.73,112.26 MOTOR_07.DIR
MDIR_08
  Bottom 0.203: MOTOR_08.DIR 44.99,88.32 44.63,87.95 44.63,85.38 U$3.27
MOTOR_MUX_RX  (via drill 0.35)
  Top 0.203: v53.91,99.32 53.91,99.14 52.25,97.47 U$3.21/A7 | U4.3 61.55,63.44 58.54,66.45 58.54,68.33 59.8,69.6 62.12,69.6 v62.14,69.57 | v69.36,88.09 69.36,86.73 R15.1 69.19,85.08 v68.9,84.79
  Bottom 0.203: v69.36,88.09 69.36,90.28 60.18,99.46 54.05,99.46 v53.91,99.32 | v68.9,84.79 68.9,84.09 62.04,77.23 62.04,69.67 v62.14,69.57
MOTOR_MUX_TX  (via drill 0.35)
  Top 0.203: v53.89,100.26 53.86,100.23 53.43,100.23 53.28,100.08 53.28,99.32 52.5,98.53 49.69,98.53 48.99,97.83 v48.99,97.08 | R15.2 70.89,88.35 v70,89.23 v69.99,89.23
  Bottom 0.203: v69.99,89.23 69.99,90.3 60.38,99.91 54.23,99.91 v53.89,100.26 | U$3.20/A6 49.72,94.93 48.99,95.66 v48.99,97.08
MOTOR_TX_RX_01  (via drill 0.35)
  Top 0.203: v71.42,63.02 71.16,62.77 69.59,62.77 69.41,62.94 U4.13
  Bottom 0.203: MOTOR_01.TX/RX 63.16,46.44 72.15,55.43 72.15,62.54 71.67,63.02 v71.42,63.02
MOTOR_TX_RX_02  (via drill 0.35)
  Top 0.2: v62.98,49.36 63.24,49.1 63.24,48.25
  Top 0.203: U4.14 69.67,63.44 69.81,63.3 70.7,63.3 v71.39,63.99 | 63.24,48.25 55.84,40.85 48.38,40.85 v48.15,41.08
  Bottom 0.203: v71.39,63.99 70.75,63.35 70.75,55.27 64.23,48.74 63.42,48.74 62.98,49.18 v62.98,49.36 | v48.15,41.08 48.53,40.69 48.53,31.93 47.16,30.56 23.81,30.56 23,31.37 23,33.36 20.59,35.77 15.05,35.77 11.24,39.58 MOTOR_02.TX/RX
MOTOR_TX_RX_03  (via drill 0.35)
  Top 0.203: v46.8,40.97 47.19,40.97 47.72,40.44 56.03,40.44 63.9,48.31 63.9,49.27 v63.82,49.35 | v70.42,63.96 67.17,63.96 U4.15
  Bottom 0.203: v46.8,40.97 46.18,40.97 42.99,37.77 42.99,32.12 41.88,31.01 37.52,31.01 36.3,32.24 MOTOR_03.TX/RX | v63.82,49.35 64.25,49.35 70.32,55.42 70.32,63.86 v70.42,63.96
MOTOR_TX_RX_04  (via drill 0.35)
  Top 0.2: 55.62,48.37 52.62,51.36
  Top 0.203: U4.12 69.16,62.44 69.29,62.31 71.11,62.31 v71.39,62.03 | 52.62,51.36 52.62,57.64 53.66,58.68 v53.81,58.68 | v50.94,63.18 50.94,62.92 50.66,62.64 42.33,62.64 v42.28,62.69 | v62.17,48.87 61.66,48.37 55.62,48.37
  Bottom 0.203: v62.17,48.87 62.6,48.87 63.21,48.27 64.38,48.27 71.59,55.48 71.59,61.83 v71.39,62.03 | v53.81,58.68 53.81,58.98 51.04,61.76 51.04,63.08 v50.94,63.18 | MOTOR_04.TX/RX 36.3,64.62 39.91,64.62 40.57,63.96 40.57,63.08 40.96,62.69 v42.28,62.69
MOTOR_TX_RX_05  (via drill 0.35)
  Top 0.2: v60.82,68.97 59.88,68.97 58.99,68.08 58.99,66.76
  Top 0.203: U4.1 65.6,65.23 65.34,65.49 60.26,65.49 58.99,66.76 | v64.07,87.16 64.63,87.72 64.63,97.56 65.09,98.01 v65.09,100.61
  Bottom 0.203: MOTOR_05.TX/RX 64.86,102.82 64.86,100.84 v65.09,100.61 | v64.07,87.16 64.86,87.16 67.42,84.6 67.42,83.18 61.64,77.4 61.64,71.73 60.72,70.81 60.72,69.07 v60.82,68.97
MOTOR_TX_RX_06  (via drill 0.35)
  Top 0.203: v51.7,62.1 51.6,62.21 43.29,62.21 42.66,61.57 42.66,60.99 v42.28,60.61 | v32.07,61.42 31.92,61.27 25.48,61.27 25.21,61.55 25.21,68.15 25.56,68.51 v25.82,68.51 | v25.11,72.75 24.31,72.75 19.52,77.54 19.52,84.28 18.1,85.71 v18,85.71 | U4.5 60.67,62.44 v60.44,62.67 | v11.12,102.14 11.12,99.4 v11.24,99.27
  Bottom 0.203: v60.44,62.67 60.36,62.75 52.14,62.75 51.7,62.31 v51.7,62.1 | 32.2,61.29 v32.07,61.42 32.95,60.54 33.12,60.37 42.04,60.37 v42.28,60.61 | v25.82,68.51 25.82,71.3 25.11,72.02 v25.11,72.75 | v18,85.71 16.56,85.71 10.99,91.28 10.99,99.01 v11.24,99.27 | v11.12,102.14 12.08,102.14 12.89,102.95 MOTOR_06.TX/RX
MOTOR_TX_RX_07  (via drill 0.35)
  Top 0.203: v62.09,64.07 62.22,63.94 U4.2 | v54.68,64.06 55.08,64.46 55.08,76.43 53.28,78.24 49.41,78.24 46.35,81.3 46.35,100.77 41.67,105.44 41.67,109.15 42.91,110.39 v42.97,110.39
  Bottom 0.203: v62.09,64.07 62.05,64.11 54.68,64.11 v54.68,64.06 | MOTOR_07.TX/RX 38.89,110.89 41.53,110.89 42.03,110.39 v42.97,110.39
MOTOR_TX_RX_08  (via drill 0.35)
  Top 0.203: U4.4 61.18,62.94 v60.67,63.45 | v54.19,63.35 54.88,63.35 55.49,63.97 55.49,76.61 53.44,78.66 49.72,78.66 46.75,81.63 46.75,94.8 v47.16,95.2
  Bottom 0.203: v60.67,63.45 60.57,63.35 v54.19,63.35 | MOTOR_08.TX/RX 47.06,98.48 47.06,95.2 v47.16,95.2
MSTEP_01  (via drill 0.35)
  Top 0.2: 30.27,82 31.87,83.6 35.68,83.6 36.48,84.4 36.48,85.52
  Top 0.203: v49.9,70.34 49.9,72.27 49.32,72.85 38.03,72.85 35.39,75.49 31.58,75.49 30.27,76.81 30.27,82 | U$3.5 36.73,94.93 39.08,92.58 39.08,86.72 38.42,86.06 37.02,86.06 36.48,85.52 | v53.56,70.69 53.33,70.46 53.33,65.26 53.94,64.65 v53.94,64.47
  Bottom 0.203: MOTOR_01.STEP 69.92,46.66 72.56,49.31 72.56,64.37 72.25,64.67 54.14,64.67 v53.94,64.47 | v53.56,70.69 53.2,70.34 v49.9,70.34
MSTEP_02  (via drill 0.35)
  Top 0.2: U$3.7 34.34,89.85 23.56,79.08
  Top 0.203: v5.26,51.02 5.26,51.27 7.8,53.81 9.15,53.81 15.12,59.78 22.31,59.78 24.32,61.78 24.32,69.38 24.52,69.58 v24.54,69.58 | v22.27,79.08 23.56,79.08
  Bottom 0.2: MOTOR_02.STEP 16.07,44.15 15.31,44.91 15.31,47.99 12.77,50.53
  Bottom 0.203: 12.77,50.53 5.74,50.53 v5.26,51.02 | v24.54,69.58 24.77,69.81 24.77,70.73 24.04,71.46 24.04,74.46 22.72,75.77 22.72,78.69 22.34,79.08 v22.27,79.08
MSTEP_03  (via drill 0.35)
  Top 0.203: v46.07,39.6 46.29,39.37 47.4,39.37 47.66,39.63 56.56,39.63 64.86,47.93 64.86,55.96 60.88,59.95 56.68,59.95 v56.4,60.23 | v38.98,80.02 39.13,79.86 39.13,75.44 39.69,74.88 50.61,74.88 52.49,73 52.49,63.73 53.76,62.46 v53.76,62.11
  Bottom 0.203: MOTOR_03.STEP 43.59,33.53 43.59,37.65 45.53,39.6 v46.07,39.6 | v38.98,80.02 39.04,80.08 39.04,82.91 38.66,83.29 38.66,85.56 38.37,85.86 36.95,85.86 35.87,84.77 U$3.9 | v56.4,60.23 55.39,60.23 53.63,61.98 v53.76,62.11
MSTEP_04  (via drill 0.35)
  Top 0.203: U$3.11 35.46,79.69 36.35,78.8 36.35,76.59 38.86,74.07 50.22,74.07 51.65,72.64 51.65,65.85 50.5,64.7 44.07,64.7 43.84,64.93 v43.8,64.9
  Bottom 0.203: v43.8,64.9 43.66,64.95 43.66,62.45 MOTOR_04.STEP
MSTEP_05  (via drill 0.35)
  Top 0.2: v64.53,85.55 64.53,85.81 65.55,86.82 65.55,95.79 66.06,96.3 v66.06,96.53 | U$3.16/A2 50.33,84.77 54.55,84.77 v54.88,84.43
  Bottom 0.2: v54.88,84.43 55.39,84.94 55.39,85.76 56.19,86.56 63.78,86.56 64.53,85.81 v64.53,85.55 | v66.06,96.53 66.06,96.59 61.77,100.87 58.72,100.87 57.47,102.11
  Bottom 0.203: MOTOR_05.STEP 57.47,104.85 57.47,102.11
MSTEP_06  (via drill 0.35)
  Top 0.203: U$3.2 35.05,102.58 33.48,102.58 31.56,104.5 20.54,104.5 19.05,103.01 v19.05,101.05
  Bottom 0.203: MOTOR_06.STEP 4.99,101.58 6.14,100.44 18.44,100.44 v19.05,101.05
MSTEP_07  (via drill 0.35)
  Top 0.203: U$3.22/A8 47.91,100.01 42.18,105.74 42.18,108.87 42.74,109.43 v42.99,109.43
  Bottom 0.203: 31.27,114.31 MOTOR_07.STEP 31.58,114.56 34.61,114.56 35.02,114.15 35.02,112.89 37.57,110.34 41.36,110.34 42.02,109.68 42.74,109.68 v42.99,109.43
MSTEP_08
  Bottom 0.203: MOTOR_08.STEP 45.02,90.78 47.06,90.78 48.73,89.11 48.73,86.25 48.37,85.89 47.19,85.89 46.5,85.2 46.5,84.23 45.24,82.97 U$3.26
N$1  (via drill 0.35)
  Top 0.203: J2.1 23.61,35.34 v23.43,35.51 | R8.2 42.95,40.21 v43.35,40.21 | v27.24,40.59 27.65,40.19 31.46,40.19 v31.82,39.83
  Bottom 0.203: v23.43,35.51 25.21,37.29 25.21,38.56 v27.24,40.59 | v43.35,40.21 42.97,39.83 v31.82,39.83
N$3
  Top 0.203: R4.2 43.33,30.69 43.84,31.2 46.29,31.2 50.1,35.01 51.5,35.01 J3.1
N$5
  Top 0.406: D10.C 47.39,113.11 U$3.VIN
N$6
  Top 0.203: U2.18 68.51,78.03 68.58,78.1 68.58,82.65 R7.1
N$8
  Top 0.203: U2.17 68.46,77.37 69.03,77.95 69.03,81.16 R12.1
N$9
  Top 0.203: U2.16 68.59,76.74 69.46,77.6 69.46,79.79 69.68,79.79 R13.1
N$10
  Top 0.61: U1.4 14.48,84.6 15.06,84.02 R11.2
N$11
  Top 0.203: U2.15 69.06,76.08 70.43,77.45 R16.1
N$12
  Top 0.203: U2.14 69.2,75.44 69.74,75.98 R17.1
N$13
  Top 0.203: R9.2 8.14,84.52 8.17,84.5
  Top 0.406: 8.17,84.5 8.27,84.6 | U1.3 8.04,84.6
  Top 0.508: R9.2 8.04,84.6
N$14
  Top 0.203: U2.13 69.53,74.78 69.81,74.5 R18.1
N$15
  Top 0.203: U2.12 69.41,74.12 70.5,73.03 R19.1
N$16
  Top 0.203: U2.11 69.03,73.49 69.66,72.85 69.66,71.58 69.79,71.45 R20.1
N$193
  Top 0.203: R10.1 63.83,144.8 STATUS_LED.1
NEOPIXEL_01_3V  (via drill 0.35)
  Top 0.203: U2.2 60.77,78.69 56.94,82.53 v56.94,82.81 | v53.5,85.43 52.8,86.13 50.87,86.13 v50.74,86 | v48.21,90.61 48.17,90.58 48.17,86.54 v48.12,86.49 | U$3.4 36.74,97.47 40.84,93.37 40.84,87.08 41.17,86.75 v45.25,86.75
  Bottom 0.203: v56.94,82.81 56.48,83.27 53.91,83.27 53.33,83.85 53.33,85.25 v53.5,85.43 | v50.74,86 49.73,86 49.29,86.44 49.29,89.48 48.21,90.56 v48.21,90.61 | v48.12,86.49 48.05,86.42 45.58,86.42 v45.25,86.75
NEOPIXEL_01_5V
  Top 0.203: P1.1 71.36,100.63 71.89,100.63 72.09,100.83 72.9,100.03 72.9,85.92 72,85.02 71.42,85.02 70.74,84.34 R7.2
NEOPIXEL_02_3V  (via drill 0.35)
  Top 0.203: U2.3 60.86,78.03 56.41,82.48 55.19,82.48 54.52,81.81 54.52,81.36 53.58,80.42 v53.51,80.42 | v53.48,77.17 50.34,77.17 U$3.13
  Bottom 0.203: v53.48,77.17 53.61,77.3 53.61,80.32 v53.51,80.42
NEOPIXEL_02_5V  (via drill 0.35)
  Top 0.203: P1.3 69.83,102.68 69.56,102.42 69.56,99.6 71.87,99.6 72.42,99.05 72.42,86.03 72.07,85.67 v71.76,85.67 | 71.4,80.98 R12.2 71.69,81.62 71.69,84.29 v71.76,84.36
  Bottom 0.203: v71.76,84.36 v71.76,85.67
NEOPIXEL_03_3V
  Top 0.203: U2.4 60.78,77.37 56.1,82.06 55.33,82.06 54.92,81.65 54.92,80.98 53.39,79.45 50.57,79.45 U$3.14/A0
NEOPIXEL_03_5V  (via drill 0.35)
  Top 0.203: P1.5 69.64,104.68 69.15,104.2 69.15,99.38 69.36,99.17 71.34,99.17 71.97,98.53 71.97,87.57 v71.82,87.41 | R13.2 71.94,79.41 72.09,79.56 72.09,83.77 72.14,83.81 v72.36,83.81
  Bottom 0.203: v71.82,87.41 72.51,86.72 72.51,83.97 v72.36,83.81
NEOPIXEL_04_3V  (via drill 0.35)
  Top 0.203: U2.5 60.76,76.74 56.05,81.45 v55.69,81.45 | v53.48,82.68 52.83,82.68 52.3,82.16 50.4,82.16 U$3.15/A1
  Bottom 0.203: v55.69,81.45 55.18,81.96 53.95,81.96 53.48,82.43 v53.48,82.68
NEOPIXEL_04_5V  (via drill 0.35)
  Top 0.203: P1.7 71.26,106.63 69.33,106.63 68.72,106.02 68.72,99.15 69.11,98.76 70.93,98.76 71.56,98.13 71.56,91.47 v71.31,91.21 | R16.2 72.75,77.45 72.9,77.6 72.9,82.86 v72.7,83.06
  Bottom 0.203: v72.7,83.06 72.96,83.33 72.96,89.66 71.41,91.21 v71.31,91.21
NEOPIXEL_05_3V  (via drill 0.35)
  Top 0.203: U2.6 60.85,76.08 56.71,80.22 56.29,80.65 v55.64,80.65 | U$3.24 47.78,81.48 48.5,80.75 52.92,80.75 v53.58,81.41
  Bottom 0.203: v55.64,80.65 55.47,80.65 54.7,81.41 v53.58,81.41
NEOPIXEL_05_5V
  Top 0.203: P1.9 72.95,108.68 73.3,108.33 73.3,76.15 73.12,75.98 R17.2
NEOPIXEL_06_3V  (via drill 0.35)
  Top 0.203: U2.7 60.91,75.44 56.54,79.82 v55.67,79.82 | U$3.25 47.78,84.29 49.06,83.01 49.06,81.51 49.42,81.16 52.18,81.16 53.05,82.03 53.78,82.03 54.36,82.6 v54.42,82.6
  Bottom 0.203: v54.42,82.6 55.52,82.6 56.3,81.83 56.3,80.22 55.94,79.87 55.72,79.87 v55.67,79.82
NEOPIXEL_06_5V
  Top 0.203: P1.11 73.46,110.68 73.7,110.44 73.7,74.76 73.45,74.5 R18.2
NEOPIXEL_07_3V  (via drill 0.35)
  Top 0.203: U2.8 60.73,74.78 56.31,79.2 55.3,79.2 54.98,79.52 v54.42,79.52 | v53.49,76.35 53.31,76.35 53.09,76.13 49.72,76.13 49.29,76.56 49.29,77.71 46.55,80.45 | 46.55,80.47 46.55,80.45 | 46.55,80.45 45.95,81.05 43.12,81.05 42.7,81.47 U$3.28
  Bottom 0.203: v54.42,79.52 54.34,79.52 54.13,79.31 54.13,76.88 53.59,76.35 v53.49,76.35
NEOPIXEL_07_5V
  Top 0.203: P1.13 73.75,112.68 74.11,112.32 74.11,73.49 73.65,73.03 R19.2
NEOPIXEL_08_3V  (via drill 0.35)
  Top 0.203: U2.9 60.65,74.12 55.99,78.79 54.76,78.79 v54.73,78.76 | U$3.29 43.58,83.9 v43.58,83.19 | v45.85,78.64 45.81,78.61 46.62,77.79 46.62,76.54 47.84,75.32 53.01,75.32 53.46,74.87 54.32,74.87 54.67,75.22 54.67,75.88 v54.36,76.19
  Bottom 0.203: v54.36,76.19 54.71,76.53 54.71,78.74 v54.73,78.76 | v45.85,78.64 45.85,79.57 43.73,81.68 43.73,83.03 v43.58,83.19
NEOPIXEL_08_5V
  Top 0.203: P1.15 74.06,114.68 74.51,114.23 74.51,72.11 73.85,71.45 R20.2
RESET  (via drill 0.35)
  Top 0.203: U$3.RESET 47.78,77.49 46.85,78.42 v46.85,78.57 | v49.01,99.37 49.41,98.97 52.14,98.97 52.85,99.67 52.85,101.17 53.71,102.03 53.71,108.95 49.91,112.75 v49.86,112.75 | v50.74,120.07 50.92,120.07 55.03,115.96 59.23,115.96 59.76,115.43 59.76,109.94 61.01,108.68 P1.10
  Bottom 0.203: v49.86,112.75 49.89,112.75 50.92,113.78 50.92,119.89 v50.74,120.07 | v46.85,78.57 46.85,79.17 44.22,81.81 44.22,89.16 43.32,90.05 42.67,90.05 42.49,90.22 42.49,91.49 42.67,91.67 47.3,91.67 v47.36,91.73 47.36,91.88 47.68,92.2 48.56,92.2 48.68,92.33 48.68,95.4 48.38,95.7 48.38,97.33 49.01,97.96 v49.01,99.37
STATUS_PIN  (via drill 0.35)
  Top 0.2: v47.87,125.35 48.25,125.35 50.99,128.09 50.99,135.65
  Top 0.203: P1.12 60.43,110.68 60.16,110.95 60.16,115.7 59.45,116.41 55.36,116.41 v50.76,121.01 | 50.99,135.65 55.18,139.84 60.45,139.84 62.13,141.52 R10.2
  Bottom 0.2: v47.87,125.35 47.95,125.35 50.76,122.53 v50.76,121.01
SX00_0  (via drill 0.35)
  Top 0.203: SX1509.27 37.11,58.56 34.89,60.79 25.14,60.79 24.72,61.2 24.72,68.38 25.19,68.84 v25.19,69.09
  Bottom 0.203: v25.19,69.09 25.31,69.22 25.31,71.05 24.5,71.86 24.5,74.66 23.15,76.01 23.15,87.43 22.23,88.35 15.81,88.35 12.71,91.45 12.71,98.25 13.99,99.52 20.18,99.52 21.45,100.79 21.45,105.47 21.1,105.77 MOTOR_06.ENA
SX00_1  (via drill 0.35)
  Top 0.203: v19.96,71.1 19.99,71.08 19.99,69.71 21.82,67.88 21.82,63.31 21.48,62.96 v21.3,63.14 | SX1509.28 36.71,58.35 34.77,60.3 24.03,60.3 v23.92,60.41
  Bottom 0.203: J1.3 14,74.15 17.06,71.1 v19.96,71.1 | v23.92,60.41 23.92,60.59 21.38,63.14 v21.3,63.14
SX00_2  (via drill 0.35)
  Top 0.203: SX1509.1 35.39,57.03 32.73,59.7 v29.89,59.7
  Bottom 0.203: MOTOR_04.ENA 28.68,60.9 v29.89,59.7
SX00_3  (via drill 0.35)
  Top 0.203: v28.84,58.35 28.84,57.84 | 28.84,57.84 | SX1509.2 30.05,56.63 28.84,57.84 | v22.41,59.13 22.64,58.9 27.12,58.9 v27.22,59 | v19.37,70.31 19.37,69.91 18.78,69.32 18.78,68.82 19.13,68.47 20.07,68.47 21.02,67.52 21.02,64.56 v20.53,64.07
  Bottom 0.203: J1.4 14.24,73.15 16.83,70.57 19.12,70.57 v19.37,70.31 | v27.22,59 28.11,59 28.77,58.35 v28.84,58.35 | v20.53,64.07 20.53,64 19.89,63.36 19.89,61.65 v22.41,59.13
SX00_4  (via drill 0.35)
  Top 0.203: v32.12,53.52 32.63,53.52 34.53,55.43 SX1509.5
  Bottom 0.203: MOTOR_03.ENA 28.68,38.3 32.03,41.65 32.03,53.43 v32.12,53.52
SX00_5  (via drill 0.35)
  Top 0.203: 35.92,55.02 SX1509.6 34.83,55.03 33.91,54.12 33.91,52.31 v33.68,52.07 | U4.11 68.9,61.93 69,61.83 69.38,61.83 v69.64,61.57 69.89,61.32 71.62,61.32 72.08,61.78 72.08,65.64 71.19,66.53 71.19,67.49 71.61,67.92 71.61,68.73 71.36,68.98 68.85,68.98 67.92,68.05 67.27,68.05 66.67,68.66 v66.67,68.97 | v52.95,49.84 52.64,49.84 51.39,48.59 49.45,48.59 48.36,49.69 43.8,49.69 42.74,50.75 v40.2,50.75
  Bottom 0.203: v66.67,68.97 66.61,69.03 66.61,72.45 68.28,74.12 70.45,74.12 J4.4 | v69.64,61.57 69.81,61.4 69.81,55.59 64.22,49.99 62.41,49.99 60.73,48.32 54.14,48.32 52.95,49.51 v52.95,49.84 | v40.2,50.75 38.8,52.15 33.76,52.15 v33.68,52.07
SX00_6  (via drill 0.35)
  Top 0.203: SX1509.7 35.37,54.63 34.33,53.6 34.33,51.31 30.34,47.32 15.18,47.32 12.36,50.14 4.38,50.14 v3.93,49.69
  Bottom 0.203: v3.93,49.69 3.98,49.64 3.98,44.51 MOTOR_02.ENA
SX00_7  (via drill 0.35)
  Top 0.203: v47.56,65.92 47.69,66.04 50.05,66.04 50.61,66.6 v50.61,66.96 | U4.10 68.09,61.44 68.67,60.87 71.84,60.87 72.56,61.58 72.56,65.89 71.69,66.76 71.69,67.42 72.07,67.79 72.07,69.03 71.7,69.4 68.41,69.4 v67.68,68.67 | SX1509.8 36.71,53.11 36.39,52.79 35.51,52.79 v35.07,53.22
  Bottom 0.152: 66.44,68.35 66.44,68.37 66.39,68.35
  Bottom 0.2: J4.5 70.44,75.13 68.53,75.13 66,72.6 66,68.35
  Bottom 0.203: v50.61,66.96 52,68.35 66,68.35 66.39,68.35 66.44,68.35 67.36,68.35 v67.68,68.67 | v47.56,65.92 47.56,65.23 48.56,64.24 48.56,53.68 48.1,53.22 47.3,53.22 46.09,54.43 36.87,54.43 35.51,55.8 34.18,55.8 33.71,55.33 33.71,53.58 34.07,53.22 v35.07,53.22
SX00_8  (via drill 0.35)
  Top 0.203: SX1509.13 38.71,53.06 40.38,51.39 42.87,51.39 44.06,50.2 48.53,50.2 49.73,49 51.17,49 52.21,50.04 52.21,58.02 57.69,63.49 57.69,69.84 v57.46,70.07 | v57.53,76.28 57.53,76.4 55.79,78.14 v55.49,78.14 | v63.03,83.6 63.03,83.01 63.46,82.59 66.16,82.59 67.78,84.21 67.78,94.14 70.55,96.91 v70.55,98.05
  Bottom 0.203: 72.71,104.85 MOTOR_05.ENA | v57.46,70.07 57.36,69.97 59.21,69.97 61.21,71.97 61.21,75.88 60.68,76.41 57.65,76.41 v57.53,76.28 57.65,76.15 | v55.49,78.14 55.7,78.14 56.43,78.87 59.52,78.87 63.03,82.38 v63.03,83.6 | MOTOR_05.ENA 72.91,105.16 | MOTOR_05.ENA 72.3,105.18 72.3,98.58 71.77,98.05 v70.55,98.05
SX00_9  (via drill 0.35)
  Top 0.203: SX1509.14 39.14,53.83 39.14,53.21 40.55,51.79 43.04,51.79 44.14,50.7 48.63,50.7 49.93,49.41 50.97,49.41 51.76,50.19 51.76,58.5 53.51,60.25 v53.53,60.25 | 56.3,61.27 58.1,63.07 58.1,68.63 59.69,70.22 61.36,70.22 v61.38,70.24 | 56.3,61.27 54.47,59.44 v54.47,59.21 | U4.9 66.1,59.39 65.77,59.06 62.35,59.06 61.05,60.35 57.22,60.35 56.3,61.27
  Bottom 0.2: J4.6 70.31,75.88 68.71,75.88 65.59,72.77 65.59,68.94 65.42,68.77 61.84,68.77 61.38,69.23 v61.38,70.24
  Bottom 0.203: v53.53,60.25 53.57,60.29 54.47,59.39 v54.47,59.21
SX00_10  (via drill 0.35)
  Top 0.203: SX1509.15 39.91,54.61 40.81,54.61 41.21,54.21 41.21,52.61 41.54,52.28 43.54,52.28 44.65,51.16 50.38,51.16 v50.41,51.13
  Bottom 0.203: v50.41,51.13 50.61,51.13 54.68,47.07 MOTOR_01.ENA
SX00_11  (via drill 0.35)
  Top 0.203: U4.6 60.32,61.94 59.84,62.42 59.84,63.12 59.69,63.26 R14.1 57.47,61.74 v57.47,61.17 | SX1509.16 43.79,55.03 45,53.83 v47.56,53.83 | v47.95,61.37 48.02,61.45 54.01,61.45 v54.58,62.02
  Bottom 0.203: v47.56,53.83 47.67,53.83 48.16,54.31 48.16,61.16 v47.95,61.37 | v57.47,61.17 56.36,62.28 54.84,62.28 v54.58,62.02
SX00_12  (via drill 0.35)
  Top 0.2: 48.58,60.89 54.3,60.89
  Top 0.203: SX1509.19 43.93,56.23 48.58,60.89 | v53.91,114.13 52.75,115.3 v48.86,115.3 | v55.64,77.34 55.67,77.34 55.9,77.12 55.9,62.48 54.3,60.89 | v63.9,83.6 64.48,83.02 65.98,83.02 67.37,84.41 67.37,94.39 69.09,96.1 69.09,96.92 v69.05,96.96
  Bottom 0.203: MOTOR_07.ENA 46.7,115.25 48.86,115.25 v48.86,115.3 | v55.64,77.34 56.53,78.23 59.74,78.23 63.9,82.39 v63.9,83.6 | v69.05,96.96 68.98,96.96 66.49,99.45 66.49,107.78 61.79,112.48 55.57,112.48 v53.91,114.13
SX00_13  (via drill 0.35)
  Top 0.203: v18.35,69.8 18.38,69.78 18.38,68.65 18.96,68.06 19.9,68.06 20.61,67.35 20.61,65.1 v19.72,64.22 | SX1509.20 43.66,56.63 47.46,60.43 v47.46,60.71 | v29.99,62.13 27.24,62.13 v26.99,61.87 | v26.99,57.61 26.99,57.99 26.61,58.37 23.66,58.37 v23.38,58.09
  Bottom 0.203: J1.5 14.48,72.15 16.83,69.8 v18.35,69.8 | v19.72,64.22 19.49,63.98 19.49,61.2 22.42,58.27 23.2,58.27 v23.38,58.09 | v26.99,61.87 26.61,61.5 26.61,57.99 v26.99,57.61 | 47.33,60.58 v47.46,60.71 47.46,59.52 47.03,59.09 42.23,59.09 41.39,59.93 30.93,59.93 29.99,60.87 v29.99,62.13
SX00_14  (via drill 0.35)
  Top 0.203: SX1509.21 39.94,57.09 43.51,57.09 46.2,59.77 v46.2,61.52 | v50.79,112.73 50.82,112.73 54.17,109.38 54.17,101.59 v53.66,101.09 | v45.61,66.86 45.71,66.76 46.78,66.76 48.49,68.47 v48.7,68.47